# EAGLE design sch_design (EAGLE 9.3.2)
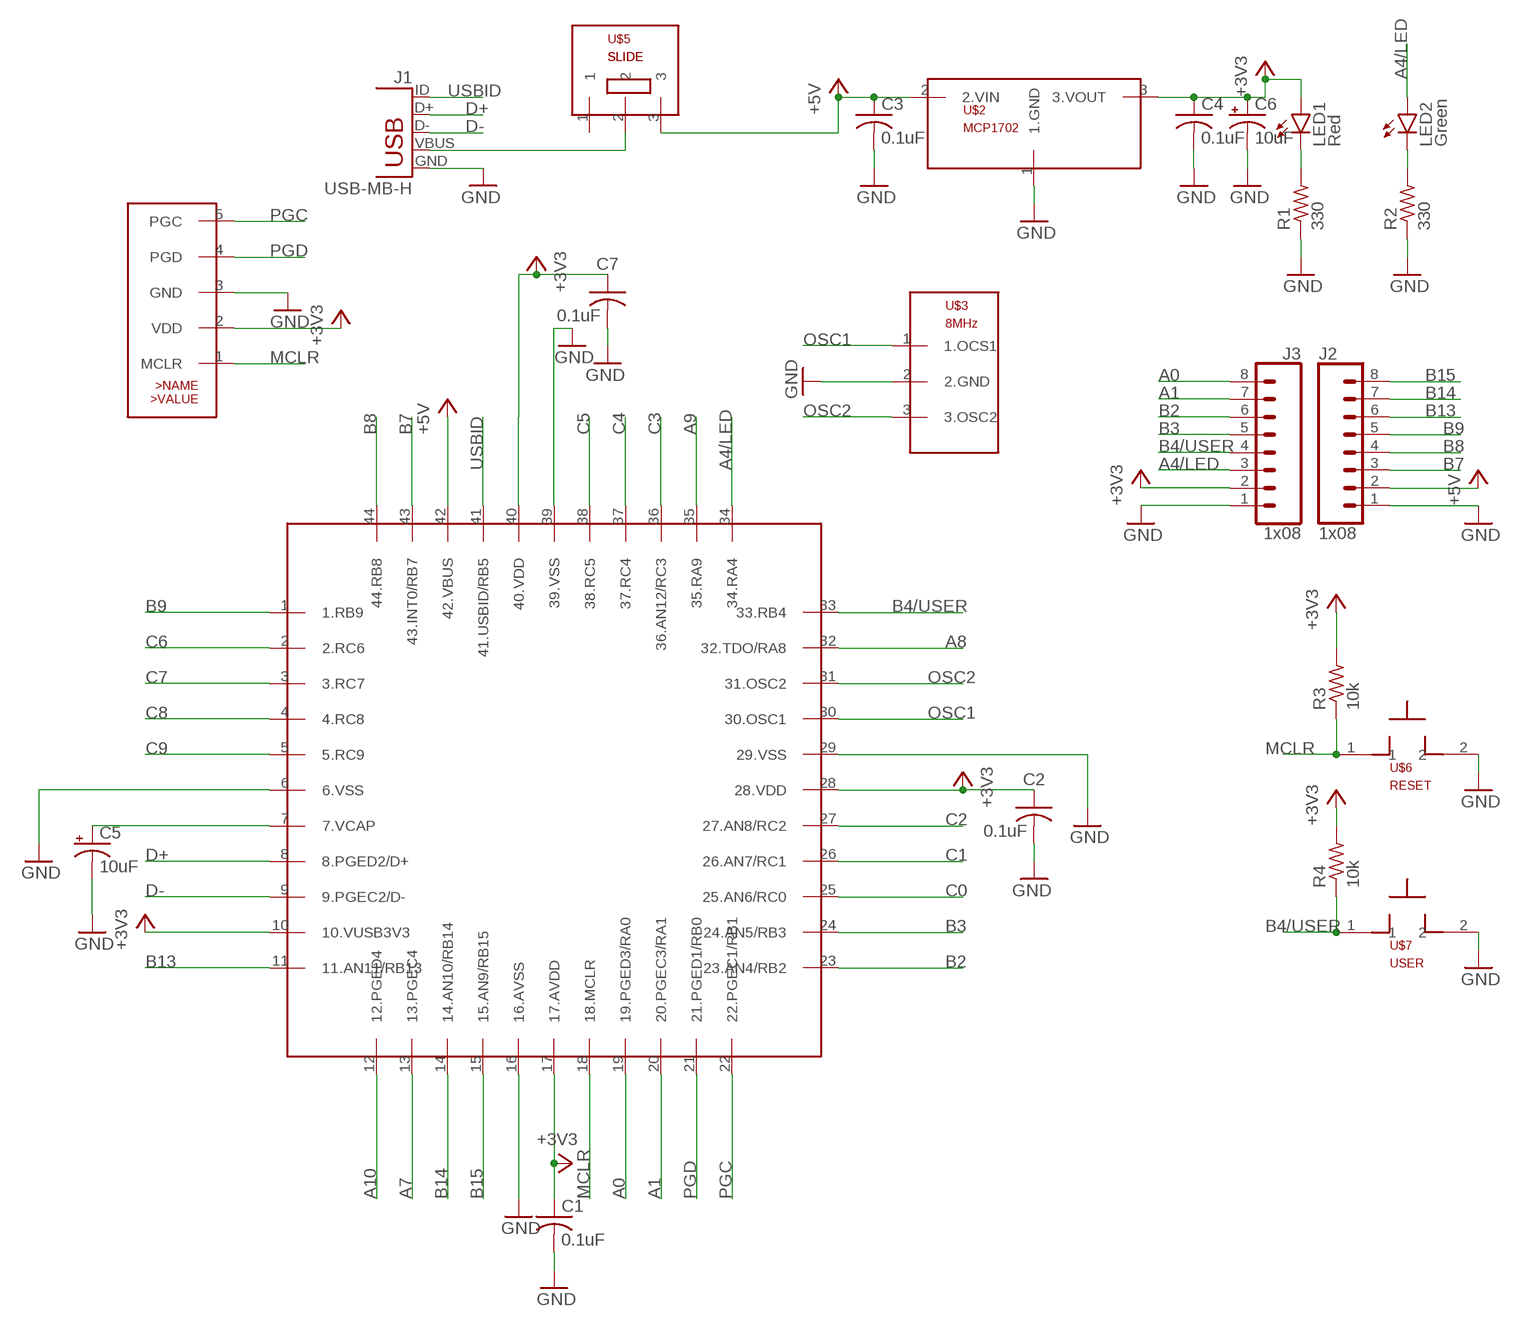
[diagram p0: schematic, sheet 1]

## Parts
C1  0.1uF  C-US025-025X050  [C025-025X050]
C2  0.1uF  C-US025-025X050  [C025-025X050]
C3  0.1uF  C-US025-025X050  [C025-025X050]
C4  0.1uF  C-US025-025X050  [C025-025X050]
C5  10uF  CPOL-USB45181B  [B45181B]
C6  10uF  CPOL-USB45181B  [B45181B]
C7  0.1uF  C-US025-025X050  [C025-025X050]
J1  USB-MB-H  [USB-MB-H]
J2  1x08  CONN_08"  [1X08]
J3  1x08  CONN_08"  [1X08]
LED1  Red  LED3MM  [LED3MM]
LED2  Green  LED3MM  [LED3MM]
R1  330  R-US_0207/10  [0207/10]
R2  330  R-US_0207/10  [0207/10]
R3  10k  R-US_0207/10  [0207/10]
R4  10k  R-US_0207/10  [0207/10]
U$2  MCP1702  [TO92]
U$3  8MHz  OSC  [OSC]
U$4  PICKIT3  [1X05]
U$5  SLIDE  [SLIDE]
U$6  RESET  PB  [PB]
U$7  USER  PB  [PB]
U$8  PIC32MX270F256D  [TQFP44]

## Nets
+3V3: C1.1 C2.1 C4.1 C6.+ C7.1 J3.2 LED1.A R3.2 R4.2 U$2.3(3.VOUT) U$4.2(VDD) U$8.10(10.VUSB3V3) U$8.17(17.AVDD) U$8.28(28.VDD) U$8.40(40.VDD)
+5V: C3.1 J2.2 U$2.2(2.VIN) U$5.3 U$8.42(42.VBUS)
A0: J3.8 U$8.19(19.PGED3/RA0)
A1: J3.7 U$8.20(20.PGEC3/RA1)
A4/LED: J3.3 LED2.A U$8.34(34.RA4)
A7: U$8.13(13.PGEC4)
A8: U$8.32(32.TDO/RA8)
A9: U$8.35(35.RA9)
A10: U$8.12(12.PGED4)
B2: J3.6 U$8.23(23.AN4/RB2)
B3: J3.5 U$8.24(24.AN5/RB3)
B4/USER: J3.4 R4.1 U$7.1 U$8.33(33.RB4)
B7: J2.3 U$8.43(43.INT0/RB7)
B8: J2.4 U$8.44(44.RB8)
B9: J2.5 U$8.1(1.RB9)
B13: J2.6 U$8.11(11.AN11/RB13)
B14: J2.7 U$8.14(14.AN10/RB14)
B15: J2.8 U$8.15(15.AN9/RB15)
C0: U$8.25(25.AN6/RC0)
C1: U$8.26(26.AN7/RC1)
C2: U$8.27(27.AN8/RC2)
C3: U$8.36(36.AN12/RC3)
C4: U$8.37(37.RC4)
C5: U$8.38(38.RC5)
C6: U$8.2(2.RC6)
C7: U$8.3(3.RC7)
C8: U$8.4(4.RC8)
C9: U$8.5(5.RC9)
D+: J1.D+ U$8.8(8.PGED2/D+)
D-: J1.D- U$8.9(9.PGEC2/D-)
GND: C1.2 C2.2 C3.2 C4.2 C5.- C6.- C7.2 J1.GND J2.1 J3.1 R1.1 R2.1 U$2.1(1.GND) U$3.2(2.GND) U$4.3(GND) U$6.2 U$7.2 U$8.6(6.VSS) U$8.16(16.AVSS) U$8.29(29.VSS) U$8.39(39.VSS)
MCLR: R3.1 U$4.1(MCLR) U$6.1 U$8.18(18.MCLR)
N$1: J1.VBUS U$5.2
N$2: C5.+ U$8.7(7.VCAP)
N$3: LED1.K(C) R1.2
N$6: LED2.K(C) R2.2
OSC1: U$3.1(1.OCS1) U$8.30(30.OSC1)
OSC2: U$3.3(3.OSC2) U$8.31(31.OSC2)
PGC: U$4.5(PGC) U$8.22(22.PGEC1/RB1)
PGD: U$4.4(PGD) U$8.21(21.PGED1/RB0)
USBID: J1.ID U$8.41(41.USBID/RB5)
Unconnected: U$5.1

## Library data of the parts
C1-C4 C7 = rcl:C-US: CAPACITOR, American symbol; SPICEPREFIX: C
C5 C6 = rcl:CPOL-US: POLARIZED CAPACITOR, American symbol; SPICEPREFIX: C
J1 = pic32_lib:USB: USB Connectors USB-B-PTH is fully proven SKU : PRT-00139/CONN-08278 USB-miniB is fully proven SKU : PRT-00587 USB-A-PCB is untested. USB-A-H is throughly reviewed, but untested. Spark Fun Electronics SKU : PRT-00437 USB-B-SMT is throughly reviewed, but untested. Needs silkscreen touching up. USB-A-S has not been used/tested USB-MB-H has not been used/tested USB-MICROB has been used. CONN-09505
J2 J3 = pic32_lib:CONN_08: Multi connection point. Often used as Generic Header-pin footprint for 0.1 inch spaced/style header connections On any of the 0.1 inch spaced packages, you can populate with these: Break Away Headers - Straight <https://www.sparkfun.com/products/116> (PRT-00116) Break Away Male Headers - Right Angle <https://www.sparkfun.com/products/553> (PRT-00553) Female Headers <https://www.sparkfun.com/products/115> (PRT-00115) Break Away Headers - Machine Pin <https://www.sparkfun.com/products/117> (PRT-00117) Break Away Female Headers - Swiss Machine Pin <https://www.sparkfun.com/products/743> (PRT-00743) Arduino Stackable Header - 8 Pin <https://www.sparkfun.com/products/9279> (PRT-09279) For SCREWTERMINALS and SPRING TERMINALS visit here: Screw Terimnals on SparkFun.com <https://www.sparkfun.com/search/results?term=Screw+Terminals> (5mm/3.5mm/2.54mm spacing) This device is also useful as a general connection point to wire up your design to another part of your project. Our various solder wires solder well into these plated through hole pads. Hook-Up Wire - Assortment (Stranded, 22 AWG) <https://www.sparkfun.com/products/11375> (PRT-11375) Hook-Up Wire - Assortment (Solid Core, 22 AWG) <https://www.sparkfun.com/products/11367> (PRT-11367) View the entire wire category on our website here <https://www.sparkfun.com/categories/141> Special notes: Molex polarized connector foot print use with SKU : PRT-08231 with associated crimp pins and housings. 1MM SMD Version SKU: PRT-10208 NOTES ON THE VARIANTS LOCK and LOCK_LONGPADS... This footprint was designed to help hold the alignment of a through-hole component (i.e. 6-pin header) while soldering it into place. You may notice that each hole has been shifted either up or down by 0.005 of an inch from it's more standard position (which is a perfectly straight line). This slight alteration caused the pins (the squares in the middle) to touch the edges of the holes. Because they are alternating, it causes a "brace" to hold the component in place. 0.005 has proven to be the perfect amount of "off-center" position when using our standard breakaway headers. Although looks a little odd when you look at the bare footprint, once you have a header in there, the alteration is very hard to notice. Also,if you push a header all the way into place, it is covered up entirely on the bottom side.; PROD_ID: CONN-08438
LED1 LED2 = led:LED: LED OSRAM: - CHIPLED LG R971, LG N971, LY N971, LG Q971, LY Q971, LO R971, LY R971 LH N974, LH R974 LS Q976, LO Q976, LY Q976 LO Q996 - Hyper CHIPLED LW Q18S LB Q993, LB Q99A, LB R99A - SideLED LS A670, LO A670, LY A670, LG A670, LP A670 LB A673, LV A673, LT A673, LW A673 LH A674 LY A675 LS A676, LA A676, LO A676, LY A676, LW A676 LS A679, LY A679, LG A679 - Hyper Micro SIDELED® LS Y876, LA Y876, LO Y876, LY Y876 LT Y87S - SmartLED LW L88C, LW L88S LB L89C, LB L89S, LG L890 LS L89K, LO L89K, LY L89K LS L896, LA L896, LO L896, LY L896 - TOPLED LS T670, LO T670, LY T670, LG T670, LP T670 LSG T670, LSP T670, LSY T670, LOP T670, LYG T670 LG T671, LOG T671, LSG T671 LB T673, LV T673, LT T673, LW T673 LH T674 LS T676, LA T676, LO T676, LY T676, LB T676, LH T676, LSB T676, LW T676 LB T67C, LV T67C, LT T67C, LS T67K, LO T67K, LY T67K, LW E67C LS E67B, LA E67B, LO E67B, LY E67B, LB E67C, LV E67C, LT E67C LW T67C LS T679, LY T679, LG T679 LS T770, LO T770, LY T770, LG T770, LP T770 LB T773, LV T773, LT T773, LW T773 LH T774 LS E675, LA E675, LY E675, LS T675 LS T776, LA T776, LO T776, LY T776, LB T776 LHGB T686 LT T68C, LB T68C - Hyper Mini TOPLED® LB M676 - Mini TOPLED Santana® LG M470 LS M47K, LO M47K, LY M47K Source: http://www.osram.convergy.de LUXEON: - LUMILED® LXK2-PW12-R00, LXK2-PW12-S00, LXK2-PW14-U00, LXK2-PW14-V00 LXK2-PM12-R00, LXK2-PM12-S00, LXK2-PM14-U00 LXK2-PE12-Q00, LXK2-PE12-R00, LXK2-PE12-S00, LXK2-PE14-T00, LXK2-PE14-U00 LXK2-PB12-K00, LXK2-PB12-L00, LXK2-PB12-M00, LXK2-PB14-N00, LXK2-PB14-P00, LXK2-PB14-Q00 LXK2-PR12-L00, LXK2-PR12-M00, LXK2-PR14-Q00, LXK2-PR14-R00 LXK2-PD12-Q00, LXK2-PD12-R00, LXK2-PD12-S00 LXK2-PH12-R00, LXK2-PH12-S00 LXK2-PL12-P00, LXK2-PL12-Q00, LXK2-PL12-R00 Source: www.luxeon.com KINGBRIGHT: KA-3528ASYC Source: www.kingbright.com
R1-R4 = rcl:R-US_: RESISTOR, American symbol; SPICEPREFIX: R
U$2 = pic32_lib:MCP1702
U$3 = pic32_lib:OSC
U$4 = pic32_lib:PICKIT3
U$5 = pic32_lib:SLIDE
U$6 U$7 = pic32_lib:PB
U$8 = pic32_lib:PIC32MX270F256D

## Board
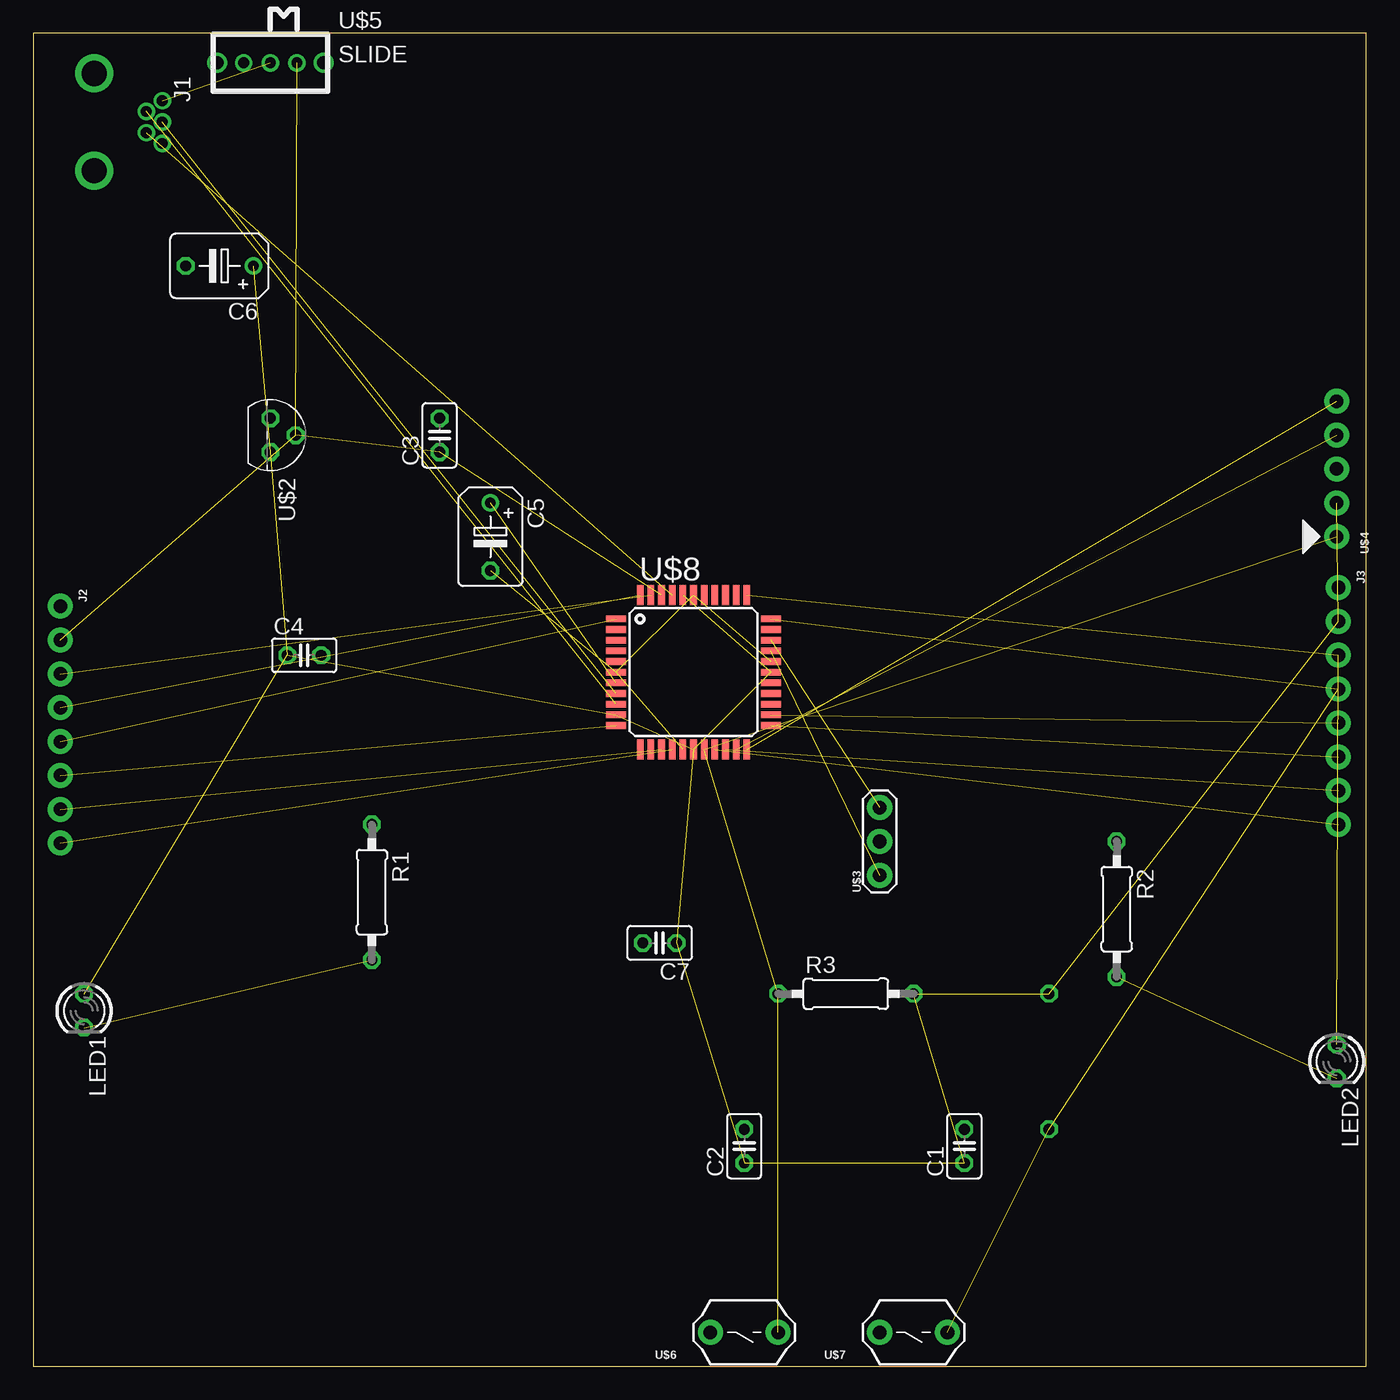
[diagram p1: board, top side]
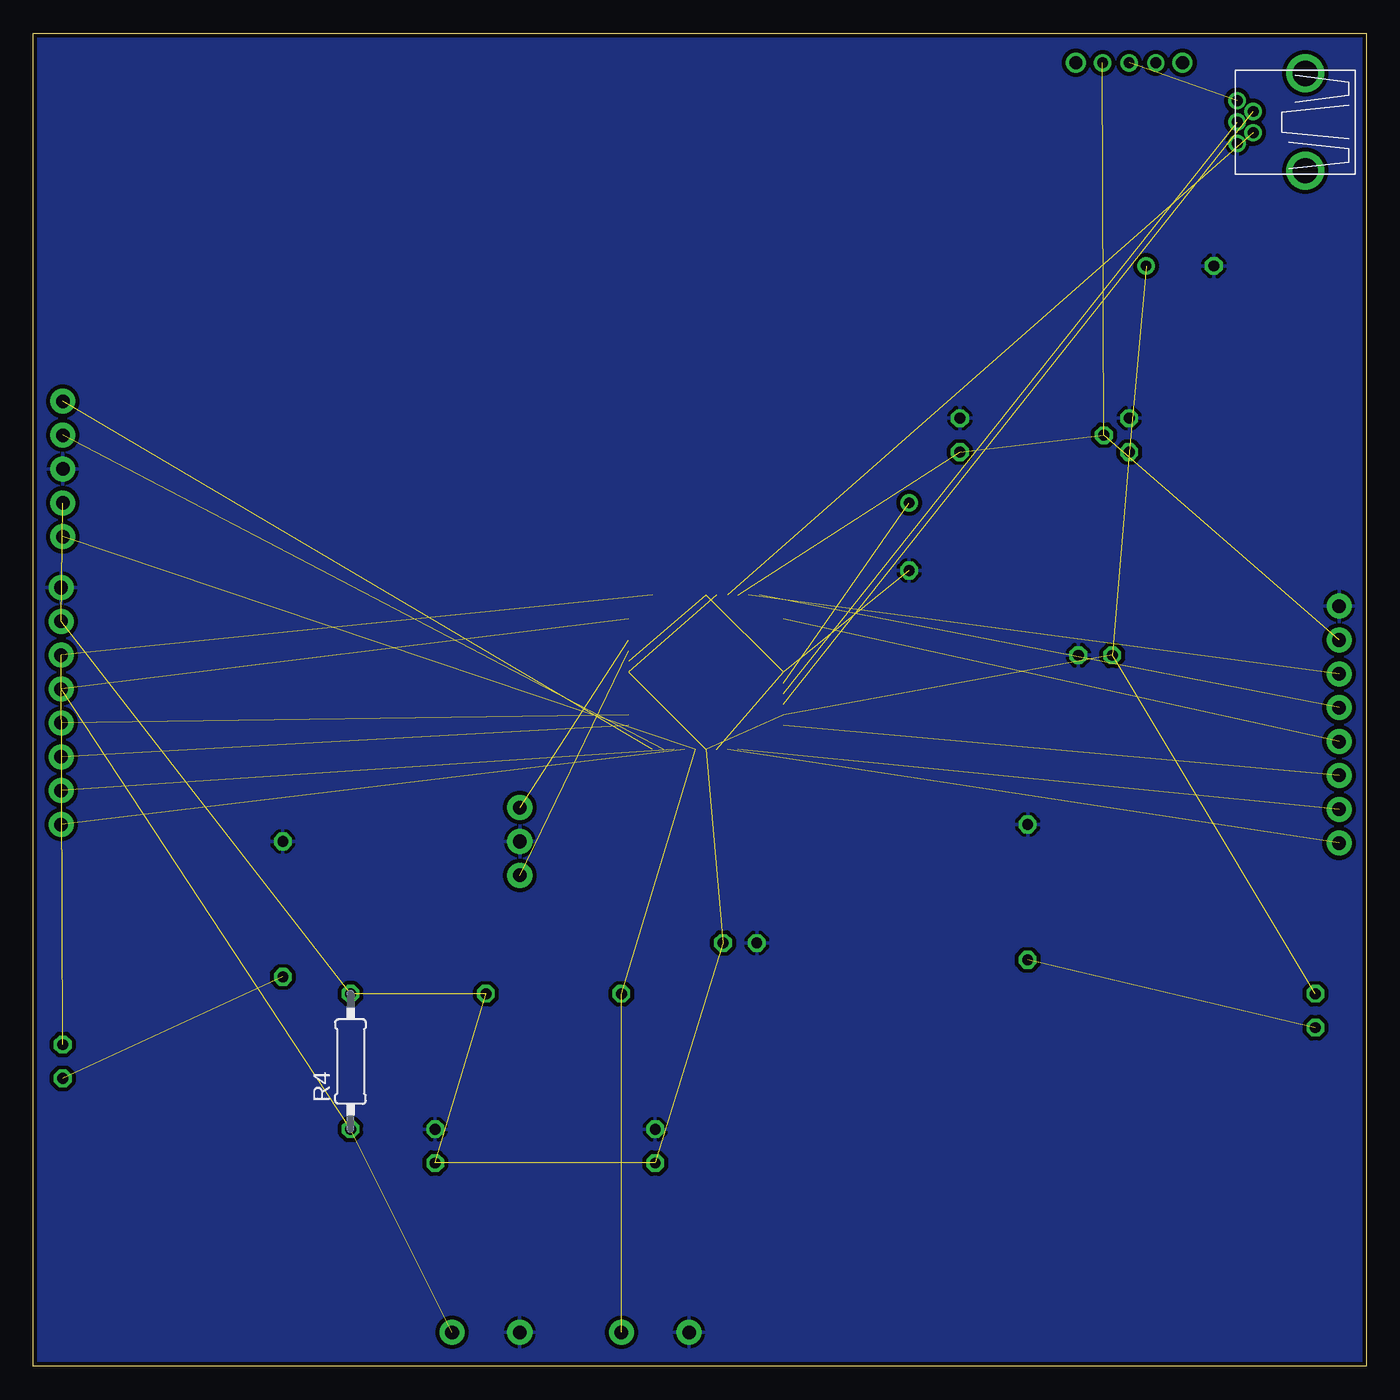
[diagram p2: board, bottom side, seen from below]

Size 100 x 100 mm. Coordinates in mm from the lower left corner, seen from the top.
Outline: 0,0 100,0 100,100 0,100 0,0
Copper layers (1*16): Top 0.035mm / dielectric 1.5mm / Bottom 0.035mm
Design rules "SeeedStudio_2layer_DRU_no_angle_20140221": minimum track width 6mil, minimum drill 12mil, track to track 6mil, track to pad 6mil, pad to pad 6mil, via to via 6mil, smd to smd 0mil, copper to edge 10mil, drill to drill 10mil, minimum pad ring 10mil, minimum via ring 6mil, stop-mask expansion 2mil, vias tented up to drill 100mil, thermal gap 10mil

### Footprints (pad centres in the part's own frame; a part is rotated, then mirrored left to right if it is on the bottom)
C025-025X050 = drill 0.813 octagon: 1 -1.27,0; 2 1.27,0
B45181B = drill 0.813: + -2.54,0 | drill 0.813 octagon: - 2.54,0
USB-MB-H = drill 0.8: D+ 5.1,0; D- 3.9,0.8; GND 5.1,-1.6; ID 3.9,-0.8; VBUS 5.1,1.6 | drill 1.9: P$6 0,-3.65; P$7 0,3.65
1X08 = drill 1.016 pad 1.88: 1 0,0; 2 2.54,0; 3 5.08,0; 4 7.62,0; 5 10.16,0; 6 12.7,0; 7 15.24,0; 8 17.78,0
LED3MM = drill 0.813 octagon: A -1.27,0; K 1.27,0
0207/10 = drill 0.813 octagon: 1 -5.08,0; 2 5.08,0
TO92 = drill 0.813 octagon: 1 -1.27,0; 2 0,1.905; 3 1.27,0
OSC = drill 1.016 pad 1.88: 1 -2.54,0; 2 0,0; 3 2.54,0
1X05 = drill 1.016 pad 1.88: 1 0,0; 2 2.54,0; 3 5.08,0; 4 7.62,0; 5 10.16,0
SLIDE = drill 0.8: 1 -2,0; 2 0,0; 3 2,0 | drill 1: P$1 -4,0; P$2 4,0
PB = drill 1.016 pad 1.88: 1 -2.54,0; 2 2.54,0
TQFP44 = smd 1.5 x 0.5: 1 -5.8,4; 2 -5.8,3.2; 3 -5.8,2.4; 4 -5.8,1.6; 5 -5.8,0.8; 6 -5.8,0; 7 -5.8,-0.8; 8 -5.8,-1.6; 9 -5.8,-2.4; 10 -5.8,-3.2; 11 -5.8,-4; 23 5.8,-4; 24 5.8,-3.2; 25 5.8,-2.4; 26 5.8,-1.6; 27 5.8,-0.8; 28 5.8,0; 29 5.8,0.8; 30 5.8,1.6; 31 5.8,2.4; 32 5.8,3.2; 33 5.8,4 | smd 0.5 x 1.5: 12 -4,-5.8; 13 -3.2,-5.8; 14 -2.4,-5.8; 15 -1.6,-5.8; 16 -0.8,-5.8; 17 0,-5.8; 18 0.8,-5.8; 19 1.6,-5.8; 20 2.4,-5.8; 21 3.2,-5.8; 22 4,-5.8; 34 4,5.8; 35 3.2,5.8; 36 2.4,5.8; 37 1.6,5.8; 38 0.8,5.8; 39 0,5.8; 40 -0.8,5.8; 41 -1.6,5.8; 42 -2.4,5.8; 43 -3.2,5.8; 44 -4,5.8

### Placement (x,y rotation side)
C1  69.85,16.51 90 top
C2  53.34,16.51 90 top
C3  30.48,69.85 90 top
C4  20.32,53.34 0 top
C5  34.29,62.23 270 top
C6  13.97,82.55 180 top
C7  46.99,31.75 180 top
J1  4.57,93.34 0 top
J2  2.03,57.02 270 top
J3  97.92,58.42 270 top
LED1  3.81,26.67 270 top
LED2  97.79,22.86 270 top
R1  25.4,35.56 270 top
R2  81.28,34.29 270 top
R3  60.96,27.94 0 top
R4  76.2,22.86 90 bottom
U$2  17.78,69.85 270 top
U$3  63.5,39.37 90 top
U$4  97.79,62.23 90 top
U$5  17.78,97.79 0 top
U$6  53.34,2.54 180 top
U$7  66.04,2.54 180 top
U$8  49.53,52.07 0 top

### Tracks (layer width: path | path; a pad name or v marks a point on that pad's centre or on a via)
+3V3  (14 unrouted)
+5V  (4 unrouted)
A0  (1 unrouted)
A1  (1 unrouted)
A4/LED  (2 unrouted)
B2  (1 unrouted)
B3  (1 unrouted)
B4/USER  (3 unrouted)
B7  (1 unrouted)
B8  (1 unrouted)
B9  (1 unrouted)
B13  (1 unrouted)
B14  (1 unrouted)
B15  (1 unrouted)
D+  (1 unrouted)
D-  (1 unrouted)
GND  (4 unrouted)
  pour Bottom (isolate 0.305): -3.81,101.6 -3.81,-5.08 105.41,-5.08 105.41,102.87 -2.54,102.87
  pour Bottom (isolate 0.305): 0.25,99.69 99.69,99.69 99.69,0.13 0.13,0.13 0,0 0,99.31 0.25,99.57
MCLR  (3 unrouted)
N$1  (via drill 0.35)  (1 unrouted)
  other vias: 9.67,94.94
N$2  (1 unrouted)
N$3  (1 unrouted)
N$6  (1 unrouted)
OSC1  (1 unrouted)
OSC2  (1 unrouted)
PGC  (1 unrouted)
PGD  (1 unrouted)
USBID  (1 unrouted)